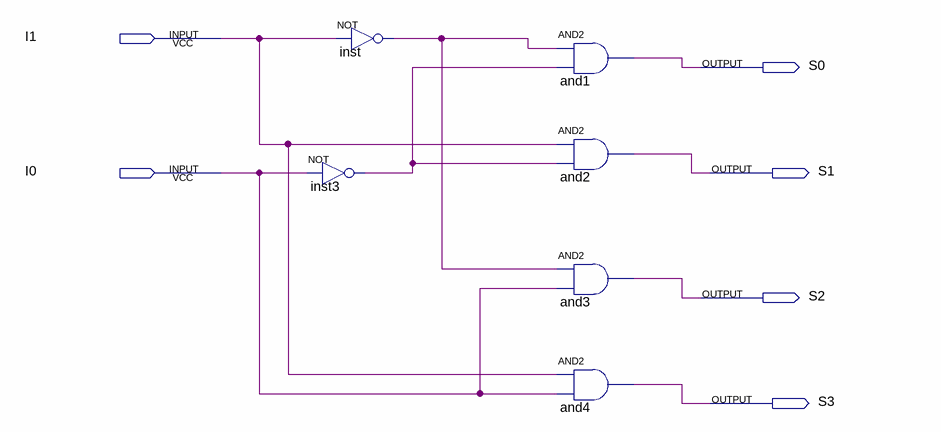
[diagram p0: schematic sheet]
// Quartus schematic decoder_2x4.bdf as structural Verilog: 6 symbols, 6 pins
module decoder_2x4 (
  input  I1,
  input  I0,
  output S0,
  output S1,
  output S2,
  output S3
);

  wire inst3_out, inst_out;

  not inst3 (inst3_out, I0);
  not inst (inst_out, I1);
  and and1 (S0, inst_out, inst3_out);
  and and2 (S1, I1, inst3_out);
  and and3 (S2, inst_out, I0);
  and and4 (S3, I1, I0);
endmodule
